# Altium schematic sheet MCU.SchDoc
size A3; Date: 20.04.2023; DrawnBy: ZEHRA; Engineer: ZEHRA; Revision: AA; SheetNumber: 3; SheetTotal: 4; PageSize: A3; Department: R&D - Hardware
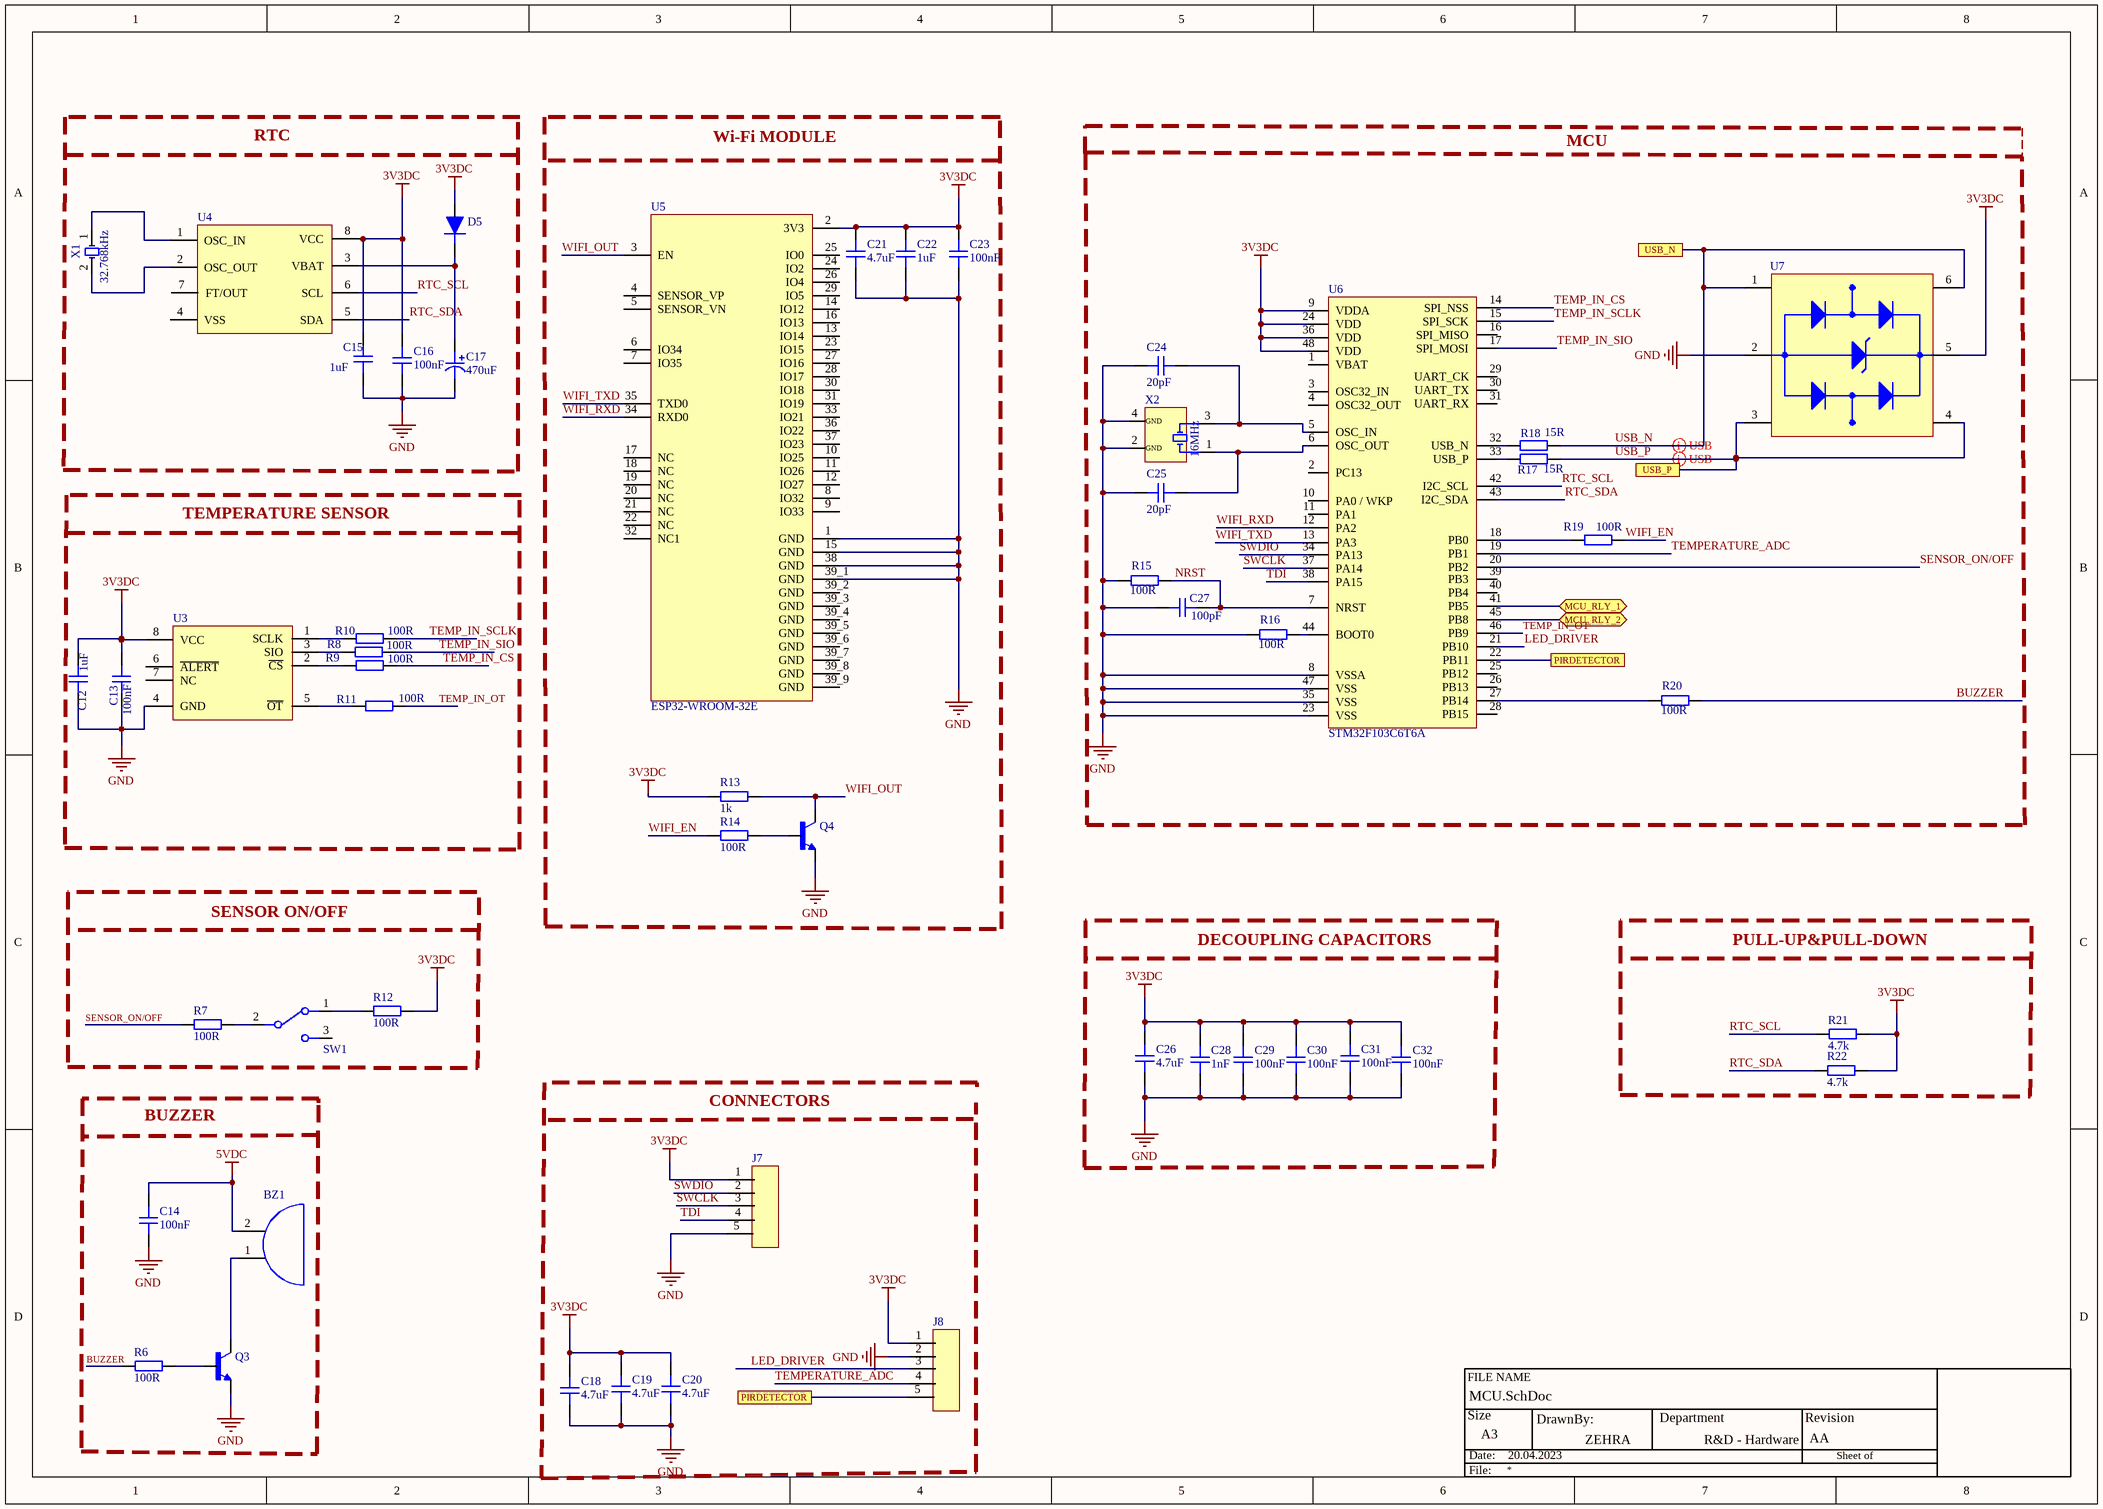
[diagram p0: MCU.SchDoc]

## Parts
BZ1  CMI-9605IC-0580T  [CMI-9605IC-0580T]  (value not drawn)
C12  1uF  [CAP_0805]
C13  100nF  [CAP_0805]
C14  100nF  [CAP_0805]
C15  1uF  [CAP_0805]
C16  100nF  [CAP_0805]
C17  470uF  [CAP_EEVSERIES]
C18  4.7uF  [CAP_0603]
C19  4.7uF  [CAP_0603]
C20  4.7uF  [CAP_0603]
C21  4.7uF  [CAP_0805]
C22  1uF  [CAP_0805]
C23  100nF  [CAP_0805]
C24  20pF  [CAP_0603]
C25  20pF  [CAP_0603]
C26  4.7uF  [CAP_0603]
C27  100pF  [CAP_0603]
C28  1nF  [CAP_0603]
C29  100nF  [CAP_0603]
C30  100nF  [CAP_0603]
C31  100nF  [CAP_0603]
C32  100nF  [CAP_0603]
D5  1N5824  [1N5824]  (value not drawn)
J7  Terminal_Block_Header  [HEADER_5]  (value not drawn)
J8  Terminal_Block_Header  [HEADER_5]  (value not drawn)
Q3  BC237  [BC237]  (value not drawn)
Q4  BC237  [BC237]  (value not drawn)
R6  100R  [RES_0805]
R7  100R  [RES_0805]
R8  100R  [RES_0805]
R9  100R  [RES_0805]
R10  100R  [RES_0805]
R11  100R  [RES_0805]
R12  100R  [RES_0805]
R13  1k  [RES_0805]
R14  100R  [RES_0805]
R15  100R  [RES_0805]
R16  100R  [RES_0805]
R17  15R  [RES_0805]
R18  15R  [RES_0805]
R19  100R  [RES_0805]
R20  100R  [RES_0805]
R21  4.7k  [RES_0805]
R22  4.7k  [RES_0805]
SW1  OS102011MA1QN1  [SWITCH]  (value not drawn)
U3  MAX6662  [SOIC-8]  (value not drawn)
U4  M41T00  [SOIC-8]  (value not drawn)
U5  ESP32-WROOM-32E  [ESP32-WROOM-32E]
U6  STM32F103C6T6A  [LQFP-48]
U7  USBLC6-2SC6  [SOT23-6L]  (value not drawn)
X1  32.768kHz  [ABS05]
X2  Frequency: 16MHz  [ECS]  (hidden comment: ECS-160-20-30B-TR)

## Blocks framed on the sheet
RTC: C15-C17 D5 U4 X1
Wi-Fi MODULE: C21-C23 Q4 R13 R14 U5
MCU: C24 C25 C27 R15-R20 U6 U7 X2
TEMPERATURE SENSOR: C12 C13 R8-R11 U3
SENSOR ON/OFF: R7 R12 SW1
DECOUPLING CAPACITORS: C26 C28-C32
PULL-UP&PULL-DOWN: R21 R22
BUZZER: BZ1 C14 Q3 R6

## Ports
MCU_RLY_1 (bidir), MCU_RLY_2 (bidir), PIRDETECTOR, USB_N, USB_P

## Nets
3V3DC: C12.2 C13.2 C15.2 C16.2 C18.2 C19.2 C20.2 C21.2 C22.2 C23.2 C26.2 C28.2 C29.2 C30.2 C31.2 C32.2 D5.1(A) J7.1 J8.1 R12.2 R13.1 R21.2 R22.2 U3.8(VCC) U4.8(VCC) U5.2(3V3) U6.9(VDDA) U6.24(VDD) U6.36(VDD) U6.48(VDD) U7.5(VBUS)
5VDC: BZ1.2 C14.2
GND: C12.1 C13.1 C14.1 C15.1 C16.1 C17.2 C18.1 C19.1 C20.1 C21.1 C22.1 C23.1 C24.1 C25.1 C26.1 C27.1 C28.1 C29.1 C30.1 C31.1 C32.1 J7.5 J8.2 Q3.1(E) Q4.1(E) R15.1 R16.1 U3.4(GND) U5.1(GND) U5.15(GND) U5.38(GND) U5.39_1(GND) U6.8(VSSA) U6.23(VSS) U6.35(VSS) U6.47(VSS) U7.2(GND) X2.2(GND) X2.4(GND)
BUZZER: R6.1 R20.2
LED_DRIVER: J8.3 U6.21(PB10)
MCU_RLY_1: U6.41(PB5) ; port MCU_RLY_1
MCU_RLY_2: U6.45(PB8) ; port MCU_RLY_2
NRST: C27.2 R15.2 U6.7(NRST)
PIRDETECTOR: J8.5 U6.22(PB11) ; port PIRDETECTOR
RTC_SCL: R21.1 U4.6(SCL) U6.42(I2C_SCL)
RTC_SDA: R22.1 U4.5(SDA) U6.43(I2C_SDA)
SENSOR_ON/OFF: R7.1 U6.20(PB2)
SWCLK: J7.3 U6.37(PA14)
SWDIO: J7.2 U6.34(PA13)
TDI: J7.4 U6.38(PA15)
TEMP_IN_CS: R9.2 U6.14(SPI_NSS)
TEMP_IN_OT: R11.2 U6.46(PB9)
TEMP_IN_SCLK: R10.2 U6.15(SPI_SCK)
TEMP_IN_SIO: R8.2 U6.17(SPI_MOSI)
TEMPERATURE_ADC: J8.4 U6.19(PB1)
USB_N: R18.2 U7.1(I/O1_IN) U7.6(I/O1_OUT) ; port USB_N
USB_P: R17.2 U7.3(I/O2_IN) U7.4(I/O2_OUT) ; port USB_P
WIFI_EN: R14.1 R19.2
WIFI_OUT: Q4.3(C) R13.2 U5.3(EN)
WIFI_RXD: U5.34(RXD0) U6.12(PA2)
WIFI_TXD: U5.35(TXD0) U6.13(PA3)
NetBZ1_1: BZ1.1 Q3.3(C)
NetC17_1: C17.1 D5.2(K) U4.3(VBAT)
NetC24_2: C24.2 U6.5(OSC_IN) X2.3
NetC25_2: C25.2 U6.6(OSC_OUT) X2.1
NetQ3_2: Q3.2(B) R6.2
NetQ4_2: Q4.2(B) R14.2
NetR7_2: R7.2 SW1.2(COM)
NetR8_1: R8.1 U3.3(SIO)
NetR9_1: R9.1 U3.2(~{CS})
NetR10_1: R10.1 U3.1(SCLK)
NetR11_1: R11.1 U3.5(~{OT})
NetR12_1: R12.1 SW1.1
NetR16_2: R16.2 U6.44(BOOT0)
NetR17_1: R17.1 U6.33(USB_P)
NetR18_1: R18.1 U6.32(USB_N)
NetR19_1: R19.1 U6.18(PB0)
NetR20_1: R20.1 U6.27(PB14)
NetU4_1: U4.1(OSC_IN) X1.1
NetU4_2: U4.2(OSC_OUT) X1.2

Not connected (* = marked no-connect by the designer): SW1 3; U3 6(~{ALERT}) 7(NC); U4 4(VSS) 7(FT/OUT); U5 4(SENSOR_VP) 5(SENSOR_VN) 6(IO34) 7(IO35) 8(IO32) 9(IO33) 10(IO25) 11(IO26) 12(IO27) 13(IO14) 14(IO12) 16(IO13) 17(NC) 18(NC) 19(NC) 20(NC) 21(NC) 22(NC) 23(IO15) 24(IO2) 25(IO0) 26(IO4) 27(IO16) 28(IO17) 29(IO5) 30(IO18) 31(IO19) 32(NC1) 33(IO21) 36(IO22) 37(IO23) 39_2(GND) 39_3(GND) 39_4(GND) 39_5(GND) 39_6(GND) 39_7(GND) 39_8(GND) 39_9(GND); U6 1(VBAT) 2(PC13) 3(OSC32_IN) 4(OSC32_OUT) 10(PA0_/_WKP) 11(PA1) 16(SPI_MISO) 25(PB12) 26(PB13) 28(PB15) 29(UART_CK) 30(UART_TX) 31(UART_RX) 39(PB3) 40(PB4)

## Layout directives
differential pair: USB_N, USB_P

## Notes on the sheet
- CONNECTORS
- (near J7) Programming Connections
- FILE NAME
- Size
- Date:
- DrawnBy:
- Department
- Revision
- Sheet of
- File:

## Library data of the parts
BZ1 = CMI-9605IC-0580T: Audio Buzzer Magnetic 3VDC 7VDC 30mA 5VDC 85dB 2600Hz to 2800Hz Through Hole Pin Box; Manufacturer: CUI Devices; Designer: ZehraOzkan; Supplier 1: Digi-Key; Manufacturer Part Number: CMI-9605IC-0580T; RoHS: No; Category: Audio Products; Stock 1: 6577; Pricing 1: 1=1,43000, 10=1,19000, 25=1,10160, 50=1,03700, 100=0,97450, 500=0,83848, 1000=0,78382, 5000=0,76810 (USD); Supplier Part Number 1: 2223-CMI-9605IC-0580T-ND
C12-C16 C21-C23 = CAP_0805_10V: Capacitor SMD 0805 10V; Designer: ZehraOzkan
C17 = CAP_ALU_68uF: Cap Aluminum Lytic 68uF 25V 20% (6.3 X 5.4mm) SMD 240mA 2000h 105C T/R; Manufacturer: KEMET; Manufacturer Part Number: EEV686M025A9GAA; Impedance: 520mR; Designer: ZehraOzkan; Supplier 1: Digi-Key; RoHS: Yes; Category: Aluminum Electrolytic Capacitors; Pricing 1: 20000=0,13757 (USD); Mount: Surface Mount; Case/Package: Radial; Min Operating Temperature: -55°C; Max Operating Temperature: 105°C; Packaging: Tape and Reel; Package Quantity: 1000; Voltage Rating: 25V; Tolerance: 20%; Ripple Current: 240mA; Voltage Rating (DC): 25V; Termination: SMD/SMT; Series: EEV; ESR (Equivalent Series Resistance): 520mR; Length: 5.4mm; RoHS Compliant: Yes; ComponentLink1URL: http://www.mouser.com/ds/2/212/KEM_A4002_EEV-535332.pdf?src-supplier=Mouser; ComponentLink1Description: http://www.mouser.com/ds/2/212/KEM_A4002_EEV-535332.pdf?src-supplier=Mouser; ComponentLink2URL: https://api.kemet.com/component-edge/download/datasheet/EEV686M025A9GAA.pdf?src-supplier=Digi-Key; ComponentLink2Description: https://api.kemet.com/component-edge/download/datasheet/EEV686M025A9GAA.pdf?src-supplier=Digi-Key; ComponentLink3URL: https://search.kemet.com/component-edge/download/datasheet/EEV686M025A9GAA.pdf?src-supplier=Digi-Key; ComponentLink3Description: https://search.kemet.com/component-edge/download/datasheet/EEV686M025A9GAA.pdf?src-supplier=Digi-Key; Supplier Part Number 1: 399-6721-2-ND
C18-C20 C24-C32 = CAP_0603_10V: Capacitor SMD 0603 10V; Deisgner: ZehraOzkan
D5 = 1N5824: Diode Schottky 30V 5A 2-Pin Axial Leaded Tray; Manufacturer: Microsemi; Forward Voltage: 490mV; Max Reverse Current: 10mA; Peak Non-Repetitive Surge Current: 500A; Element Configuration: Single; Designer: ZehraOzkan; Supplier 1: Newark; Manufacturer Part Number: 1N5824; RoHS: Yes; Category: Rectifier Diodes; Mount: Through Hole; Case/Package: Axial; Number of Pins: 2; Min Operating Temperature: -65°C; Max Operating Temperature: 125°C; Packaging: Bulk; Series: -; Forward Current: 5A; Average Rectified Current: 5A; Max Repetitive Reverse Voltage (Vrrm): 30V; Max Reverse Voltage (DC): 30V; Radiation Hardening: No; RoHS Compliant: Yes; ComponentLink1URL: http://www.microsemi.com/document-portal/doc_download/5865-1n5823-25-pdf?src-supplier=Avnet; ComponentLink1Description: http://www.microsemi.com/document-portal/doc_download/5865-1n5823-25-pdf?src-supplier=Avnet; ComponentLink2URL: https://www.microsemi.com/document-portal/doc_download/5865-1n5823-25-datasheet?src-supplier=Digi-Key; ComponentLink2Description: https://www.microsemi.com/document-portal/doc_download/5865-1n5823-25-datasheet?src-supplier=Digi-Key; ComponentLink3URL: http://www.microsemi.com/datasheets/1N5823-25.PDF?src-supplier=Mouser; ComponentLink3Description: http://www.microsemi.com/datasheets/1N5823-25.PDF?src-supplier=Mouser; Supplier Part Number 1: 34AJ0587
J7 J8 = Terminal_Block_Header: 5 pin Female; Designer: ZehraOzkan
Q3 Q4 = BC237: Transistor NPN BC237B MOTOROLA milliampere=100 V=45 R204; Manufacturer: ON Semiconductor / Fairchild; Voltage Rating (DC): 45V; hFE Min: 200; Max Power Dissipation: 500mW; Max Collector Current: 100mA; Transition Frequency: 250MHz; Collector Base Voltage (VCBO): 50V; Emitter Base Voltage (VEBO): 6V; Element Configuration: Single; Gain Bandwidth Product: 200MHz; Collector Emitter Saturation Voltage: 200mV; Collector-emitter Voltage-Max: 600mV; Number of Elements: 1; Designer: ZehraOzkan; Supplier 1: Avnet; Manufacturer Part Number: BC237B; RoHS: No; Category: BJTs; Stock 1: 16416; Pricing 1: 8013=0,04618, 8100=0,04493, 17000=0,04368, 41000=0,04243, 81000=0,04118, 410000=0,03994, 810000=0,03869 (USD); Mount: Through Hole; Case/Package: TO-92-3; Number of Pins: 3; Min Operating Temperature: -55°C; Max Operating Temperature: 150°C; Package Quantity: 2000; Packaging: Bulk; Collector Emitter Voltage (VCEO): 45V; Polarity: NPN; Collector Emitter Breakdown Voltage: 45V; Current Rating: 100mA; Series: -; Frequency: 250MHz; Power Dissipation: 500mW; Lead Free: Lead Free; RoHS Compliant: No; ComponentLink1URL: https://datasheet.ciiva.com/982/bc23x-982404.pdf?src-supplier=Digi-Key; ComponentLink1Description: https://datasheet.ciiva.com/982/bc23x-982404.pdf?src-supplier=Digi-Key; Supplier Part Number 1: BC237B
R6-R22 = RES_0805: Resistor SMD 0805; Designer: ZehraOzkan
SW1 = Switch: Designer: ZehraOzkan
U3 = MAX6662: Temp Sensor Digital Serial (3-Wire, SPI) 8-Pin SOIC N Tube; Manufacturer: Maxim; Manufacturer Part Number: MAX6662MSA+; Output Type: Digital,SPI; Max Supply Voltage (DC): 5.5V; Min Supply Voltage (DC): 3V; Resolution: 12b; Operating Supply Current: 600uA; Max Power Dissipation: 471mW; Number of Bits: 12; Designer: ZehraOzkan; Supplier 1: Digi-Key; RoHS: Yes; Category: Temperature and Humidity Sensors; Pricing 1: 1=5,22, 5=4,606, 10=4,068, 25=3,3008, 50=2,9168, 100=2,8401, 500=2,37956, 1000=2,22604 (USD); Case/Package: SOIC; Number of Pins: 8; Min Operating Temperature: -55°C; Max Operating Temperature: 150°C; Interface: SPI; Packaging: Rail/Tube; Series: -; Max Supply Voltage: 5.5V; Min Supply Voltage: 3V; Length: 5mm; Width: 4mm; Height: 1.5mm; Radiation Hardening: No; RoHS Compliant: Yes; Lead Free: Lead Free; Reach SVHC Compliant: Unknown; ComponentLink1URL: https://datasheet.ciiva.com/5299/max6662-89142-5299456.pdf?src-supplier=Mouser; ComponentLink1Description: https://datasheet.ciiva.com/5299/max6662-89142-5299456.pdf?src-supplier=Mouser; ComponentLink2URL: https://datasheet.ciiva.com/3277/max6662-3277979.pdf?src-supplier=Avnet; ComponentLink2Description: https://datasheet.ciiva.com/3277/max6662-3277979.pdf?src-supplier=Avnet; ComponentLink3URL: https://datasheet.ciiva.com/2003/max6662-2003390.pdf?src-supplier=Digi-Key; ComponentLink3Description: https://datasheet.ciiva.com/2003/max6662-2003390.pdf?src-supplier=Digi-Key; Supplier Part Number 1: MAX6662MSA+-ND
U4 = M41T00M6F: Real-time Clocks Clock/Calendar I2C, 2-Wire Serial 70uA @ 2V ~ 5.5V SOIC-8_150mil RoHS; Manufacturer: STMicroelectronics; Designer: ZehraOzkan; Time Format: HH:MM:SS; Interface: I2C,Serial,2-Wire; Date Format: YY-MM-DD-dd; Logic Function: Clock; Non-volatile Memory Size: 8B; Supplier 1: Digi-Key; Manufacturer Part Number: M41T00M6F; RoHS: Yes; Category: Real Time Clocks; Stock 1: 2374; Pricing 1: 1=3,96000, 10=3,55600, 25=3,36160, 100=2,91340, 250=2,76404, 500=2,48016, 1000=2,11425 (USD); Mount: Surface Mount; Case/Package: SOIC; Number of Pins: 8; Weight: 0.019048oz; Min Operating Temperature: -40°C; Max Operating Temperature: 85°C; Packaging: Tape and Reel; Max Supply Voltage: 5.5V; Min Supply Voltage: 2V; Series: -; Supply Voltage-Nom: 5.5V; Memory Size: 8B; RAM Size: 8B; Length: 5mm; Width: 4mm; Height: 1.5mm; Radiation Hardening: No; RoHS Compliant: Yes; Lead Free: Lead Free; Temperature Grade: INDUSTRIAL; Reach SVHC Compliant: No; ComponentLink1URL: https://datasheet.ciiva.com/16213/cd00001542-16213654.pdf?src-supplier=Future+Electronics; ComponentLink1Description: https://datasheet.ciiva.com/16213/cd00001542-16213654.pdf?src-supplier=Future+Electronics; ComponentLink2URL: https://datasheet.ciiva.com/7630/1837112-7630077.pdf?src-supplier=Element14; ComponentLink2Description: https://datasheet.ciiva.com/7630/1837112-7630077.pdf?src-supplier=Element14; ComponentLink3URL: https://datasheet.ciiva.com/41459/001185345-da-01-en-ic-rtc-srl-512kbit-m41t00m6f-soic-8-stm-41459818.pdf?src-supplier=Conrad; ComponentLink3Description: https://datasheet.ciiva.com/41459/001185345-da-01-en-ic-rtc-srl-512kbit-m41t00m6f-soic-8-stm-41459818.pdf?src-supplier=Conrad; Supplier Part Number 1: 497-4697-1-ND
U5 = ESP32-WROOM-32E: Bluetooth, WiFi 802.11b/g/n, Bluetooth v4.2 +EDR, Class 1, 2 and 3 Transceiver Module 2.4GHz ~ 2.5GHz Integrated, Trace Surface Mount; Manufacturer: Espressif; Designer: ZehraOzkan; Interface: I2C,I2S,SPI,UART; Max Supply Voltage: 3.6V; Min Supply Voltage: 3V; Min Operating Temperature: -40°C; MAX Operating Temperature: 85°C; Packaging: Tray
U6 = STM32F103C6T6A: MCU 32-bit STM32F ARM Cortex M3 RISC 32KB Flash 2.5V/3.3V 48-Pin LQFP Tray; Manufacturer: STMicroelectronics; Number of Timers/Counters: 3; Max Supply Voltage: 3.6V; Interface: I2C,SPI,USART; RAM Size: 10KB; Number of I/Os: 37; Min Supply Voltage: 2V; Data Bus Width: 32b; Max Frequency: 72MHz; Number of ADC Channels: 10; Designer: ZehraOzkan; Supplier 1: Digi-Key; Manufacturer Part Number: STM32F103C6T6A; RoHS: Yes; Category: Microcontrollers; Stock 1: 341; Pricing 1: 1=6,61, 10=5,939, 25=5,6144, 80=4,86588, 250=4,6164, 500=4,14228, 1000=3,49349, 2500=3,40275 (USD); Case/Package: LQFP; Number of Pins: 48; Weight: 0.006409oz; Min Operating Temperature: -40°C; Max Operating Temperature: 85°C; Packaging: Tray; Series: STM32F103C6; Package Quantity: 1500; Memory Type: FLASH; Memory Size: 32KB; Core Architecture: ARM; Length: 7mm; Width: 7mm; Height: 1.4mm; Lead Free: Lead Free; RoHS Compliant: Yes; ComponentLink1URL: https://datasheet.ciiva.com/15122/getdatasheetpartid-69879-15122075.pdf?src-supplier=Verical; ComponentLink1Description: https://datasheet.ciiva.com/15122/getdatasheetpartid-69879-15122075.pdf?src-supplier=Verical; ComponentLink2URL: https://datasheet.ciiva.com/14100/pustm-arm-microcont-stm32f103-en-14100507.pdf?src-supplier=Distrelec; ComponentLink2Description: https://datasheet.ciiva.com/14100/pustm-arm-microcont-stm32f103-en-14100507.pdf?src-supplier=Distrelec; Supplier Part Number 1: 497-11515-ND
U7 = USB PROTECTION: TVS DIODE 5.25VWM 17VC SOT23-6; Manufacturer: STMicroelectronics; Capacitance: 3.5pF; Leakage Current: 150nA; Direction: Unidirectional,Bidirectional; Operating Supply Voltage: 1.1V; Number of Channels: 2; Breakdown Voltage: 6V; Clamping Voltage: 17V; Reverse Standoff Voltage: 5.25V; Power Line Protection: Yes; Test Current: 1mA; Peak Pulse Current: 5A; Data Rate: 480Mbps; Number of Elements: 1; Working Voltage: 5V; Designer: ZehraOzkan; Supplier 1: Digi-Key; Manufacturer Part Number: USBLC6-2SC6; RoHS: Yes; Category: TVS Diodes; Stock 1: 33081; Pricing 1: 1=0,59, 10=0,507, 100=0,3787, 500=0,29752, 1000=0,22991 (USD); Mount: Surface Mount; Case/Package: SOT-23; Number of Pins: 6; Min Operating Temperature: -40°C; Max Operating Temperature: 125°C; Packaging: Tape and Reel; Termination: SMD/SMT; Series: USB; Package Quantity: 3000; Polarity: Unidirectional,Bidirectional; Number of Bidirectional Channels: 2; Min Breakdown Voltage: 6V; ESD Protection: Yes; Max Reverse Leakage Current: 150nA; Reverse Breakdown Voltage: 6V; Max Breakdown Voltage: 6V; Clamping Voltage-Max: 17V; Length: 3.05mm; Width: 1.75mm; Height: 1.3mm; Depth: 1.75mm; Radiation Hardening: No; Reach SVHC Compliant: No; Lead Free: Lead Free; RoHS Compliant: Yes; ComponentLink1URL: https://datasheet.ciiva.com/1268/1690354-1268384.pdf?src-supplier=Element14; ComponentLink1Description: https://datasheet.ciiva.com/1268/1690354-1268384.pdf?src-supplier=Element14; ComponentLink2URL: https://datasheet.ciiva.com/4508/cd00050750-113117-4508433.pdf?src-supplier=Mouser; ComponentLink2Description: https://datasheet.ciiva.com/4508/cd00050750-113117-4508433.pdf?src-supplier=Mouser; ComponentLink3URL: https://datasheet.ciiva.com/15143/getdatasheetpartid-148465-15143789.pdf?src-supplier=Verical; ComponentLink3Description: https://datasheet.ciiva.com/15143/getdatasheetpartid-148465-15143789.pdf?src-supplier=Verical; ComponentLink4URL: https://datasheet.ciiva.com/16200/cd00050750-16200026.pdf?src-supplier=Future+Electronics; ComponentLink4Description: https://datasheet.ciiva.com/16200/cd00050750-16200026.pdf?src-supplier=Future+Electronics; ComponentLink5URL: https://datasheet.ciiva.com/41444/001184109-da-01-en-ic-esd-protecti-usblc6-2sc6-sot-23-6-stm-41444156.pdf?src-supplier=Conrad; ComponentLink5Description: https://datasheet.ciiva.com/41444/001184109-da-01-en-ic-esd-protecti-usblc6-2sc6-sot-23-6-stm-41444156.pdf?src-supplier=Conrad; Supplier Part Number 1: 497-5235-6-ND
X1 = Crystal 32768kHz: Crystal 0.032768MHz ±20ppm (Tol) 12.5pF Flexural 90000Ohm 2-Pin CSMD T/R; Manufacturer: Abracon; Manufacturer Part Number: ABS05-32.768KHZ-T; ESR (Equivalent Series Resistance): 90kR; Designer: ZehraOzkan; Supplier 1: Digi-Key; RoHS: Yes; Category: Crystals; Stock 1: 357060; Pricing 1: 1=0,75, 10=0,628, 50=0,565, 100=0,5022, 500=0,4771, 1000=0,40177 (USD); Mount: Surface Mount; Case/Package: CSMD; Number of Pins: 2; Min Operating Temperature: -40°C; Max Operating Temperature: 85°C; Packaging: Tape and Reel; Frequency Tolerance: 20ppm; Load Capacitance: 12.5pF; Package Quantity: 3000; Frequency: 32.768kHz; Tolerance: 20ppm; Termination: SMD/SMT; Series Resistance: 90kR; Series: ABS05; Operating Frequency: 32.768 kHz; Length: 1.6mm; Width: 1mm; Height: 0.5mm; Depth: 1mm; Radiation Hardening: No; Reach SVHC Compliant: No; Lead Free: Lead Free; RoHS Compliant: Yes; ComponentLink1URL: https://datasheet.ciiva.com/23810/abs05-23810480.pdf?src-supplier=Newark; ComponentLink1Description: https://datasheet.ciiva.com/23810/abs05-23810480.pdf?src-supplier=Newark; ComponentLink2URL: https://datasheet.ciiva.com/6728/abs05-6728949.pdf?src-supplier=Digi-Key; ComponentLink2Description: https://datasheet.ciiva.com/6728/abs05-6728949.pdf?src-supplier=Digi-Key; ComponentLink3URL: https://datasheet.ciiva.com/6728/abs05-6728950.pdf?src-supplier=Digi-Key; ComponentLink3Description: https://datasheet.ciiva.com/6728/abs05-6728950.pdf?src-supplier=Digi-Key; ComponentLink4URL: https://datasheet.ciiva.com/16411/abs05-16411149.pdf?src-supplier=Future+Electronics; ComponentLink4Description: https://datasheet.ciiva.com/16411/abs05-16411149.pdf?src-supplier=Future+Electronics; Supplier Part Number 1: 535-11899-1-ND
X2 = Crystal 16MHz: Crystal 16MHz ±30ppm (Tol) ±50ppm (Stability) 20pF FUND 50Ohm 4-Pin Mini-SMD T/R; Manufacturer: ECS International; ESR (Equivalent Series Resistance): 50R; Designer: ZehraOzkan; Supplier 1: Digi-Key; Manufacturer Part Number: ECS-160-20-30B-TR; RoHS: Yes; Category: Crystals; Stock 1: 30392; Pricing 1: 1=0,75, 10=0,628, 50=0,5648, 100=0,5021, 500=0,47702 (USD); Mount: Surface Mount; Case/Package: SMD/SMT; Min Operating Temperature: 0°C; Max Operating Temperature: 70°C; Frequency Tolerance: 30ppm; Load Capacitance: 20pF; Packaging: Tape and Reel; Frequency Stability: 50ppm; Package Quantity: 1000; Series: ECX-53B; Tolerance: 50ppm; Termination: SMD/SMT; Length: 5mm; Width: 3.2mm; Height: 0.85mm; Lead Free: Lead Free; RoHS Compliant: Yes; ComponentLink1URL: https://datasheet.ciiva.com/853/ecx-53b-853408.pdf?src-supplier=Digi-Key; ComponentLink1Description: https://datasheet.ciiva.com/853/ecx-53b-853408.pdf?src-supplier=Digi-Key; ComponentLink2URL: https://datasheet.ciiva.com/853/ecx-53b-853407.pdf?src-supplier=Digi-Key; ComponentLink2Description: https://datasheet.ciiva.com/853/ecx-53b-853407.pdf?src-supplier=Digi-Key; ComponentLink3URL: https://datasheet.ciiva.com/853/ecx-53b-853406.pdf?src-supplier=Digi-Key; ComponentLink3Description: https://datasheet.ciiva.com/853/ecx-53b-853406.pdf?src-supplier=Digi-Key; Supplier Part Number 1: XC1120CT-ND